# EAGLE design USB_MiniPower (EAGLE 7.7.0)
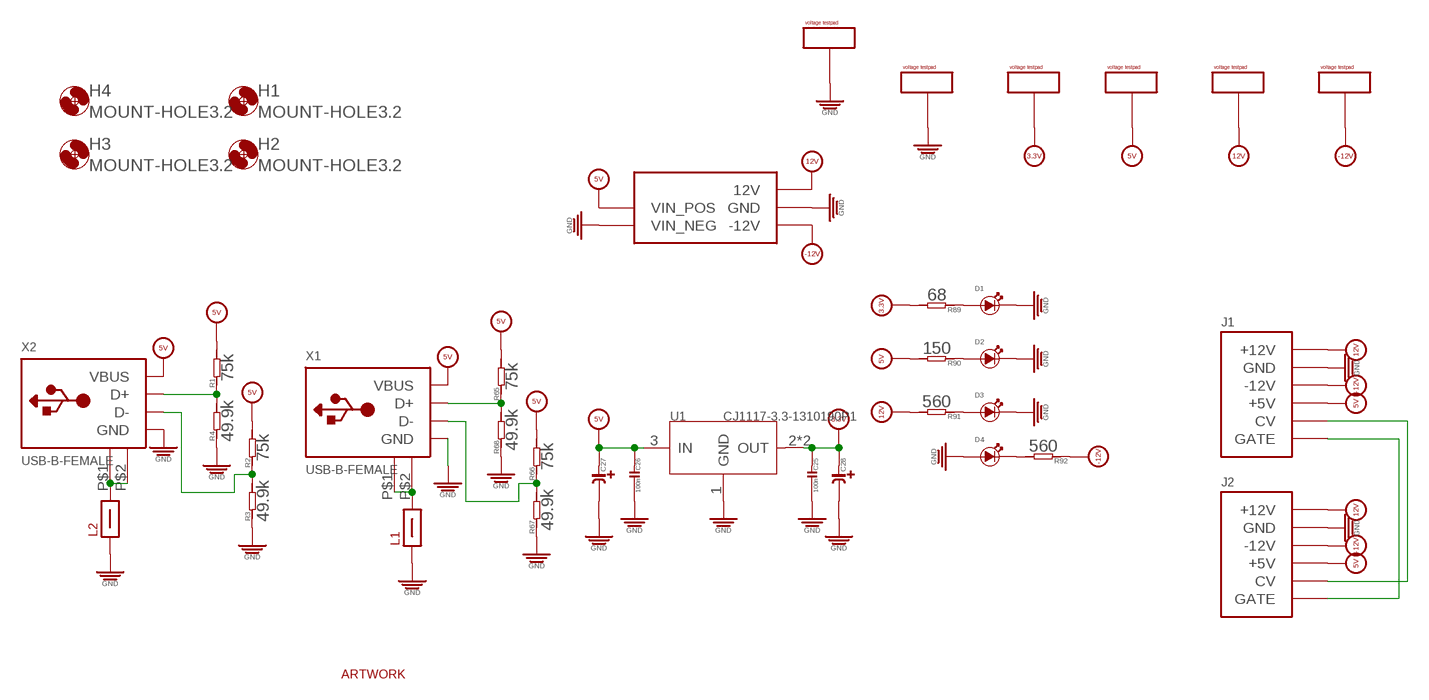
[diagram p0: schematic, sheet 1]

## Parts
C25  100n  C-0603  [C0603]
C26  100n  C-0603  [C0603]
C27  C-POLAR-A  [CASE-A_3216]
C28  C-POLAR-A  [CASE-A_3216]
D1  LED  [LED0603]
D2  LED  [LED0603]
D3  LED  [LED0603]
D4  LED  [LED0603]
H1  MOUNT-HOLE3.2  [3,2]
H2  MOUNT-HOLE3.2  [3,2]
H3  MOUNT-HOLE3.2  [3,2]
H4  MOUNT-HOLE3.2  [3,2]
J1  POWER_SHROUDED_NOTEXT  [POWER_16_SHROUDED_NOTEXT]
J2  POWERSHROUDED  [POWER_16_SHROUDED]
L1  FERRITE_1812  [FERRITE_1812]
L2  FERRITE_1812  [FERRITE_1812]
R1  75k  R-0603  [R0603]
R2  75k  R-0603  [R0603]
R3  49.9k  R-0603  [R0603]
R4  49.9k  R-0603  [R0603]
R65  75k  R-0603  [R0603]
R66  75k  R-0603  [R0603]
R67  49.9k  R-0603  [R0603]
R68  49.9k  R-0603  [R0603]
R89  68  R-0603  [R0603]
R90  150  R-0603  [R0603]
R91  560  R-0603  [R0603]
R92  560  R-0603  [R0603]
U1  CJ1117-3.3-1310190P1  [SOT223]
U$7  VOLTAGETESTPAD_BIG  [POWERTESTPAD_BIG]
U$8  VOLTAGETESTPAD_BIG  [POWERTESTPAD_BIG]
U$9  VOLTAGETESTPAD_BIG  [POWERTESTPAD_BIG]
U$10  VOLTAGETESTPAD_BIG  [POWERTESTPAD_BIG]
U$11  VOLTAGETESTPAD_BIG  [POWERTESTPAD_BIG]
U$16  VOLTAGETESTPAD_BIG  [POWERTESTPAD_BIG]
U$17  TINRS_ARTWORKTINYDATE  [JUSTATINYROCKET_DATECODE]
U$42  CINCONBRICK_12V  [CINCONBRICK]
X1  USB-B-FEMALE  [FCI61729]
X2  USB-B-FEMALE  [FCI61729]

## Nets
3.3V [5v]: C25.1 C28.+ R89.2 U1.2(OUT) U1.TER(OUT) U$7.P$1(VOLTAGE) U$7.P$2(VOLTAGE) U$7.P$3(VOLTAGE)
5V [5v]: C26.1 C27.+ J1.11(+5V) J1.12(+5V) J2.11(+5V) J2.12(+5V) R1.2 R2.2 R65.2 R66.2 R90.2 U1.3(IN) U$8.P$1(VOLTAGE) U$8.P$2(VOLTAGE) U$8.P$3(VOLTAGE) U$42.1(VIN_POS) U$42.24(VIN_POS) X1.1(VBUS) X2.1(VBUS)
12V [5v]: J1.9(+12V) J1.10(+12V) J2.9(+12V) J2.10(+12V) R91.2 U$9.P$1(VOLTAGE) U$9.P$2(VOLTAGE) U$9.P$3(VOLTAGE) U$42.11(12V) U$42.14(12V)
-12V [5v]: J1.1(-12V) J1.2(-12V) J2.1(-12V) J2.2(-12V) R92.1 U$10.P$1(VOLTAGE) U$10.P$2(VOLTAGE) U$10.P$3(VOLTAGE) U$42.2(-12V) U$42.23(-12V)
GND: C25.2 C26.2 C27.- C28.- D1.- D2.- D3.- D4.+ J1.3(GND) J1.4(GND) J1.5(GND) J1.6(GND) J1.7(GND) J1.8(GND) J2.3(GND) J2.4(GND) J2.5(GND) J2.6(GND) J2.7(GND) J2.8(GND) L1.P$1 L2.P$1 R3.1 R4.1 R67.1 R68.1 U1.1(GND) U$11.P$1(VOLTAGE) U$11.P$2(VOLTAGE) U$11.P$3(VOLTAGE) U$16.P$1(VOLTAGE) U$16.P$2(VOLTAGE) U$16.P$3(VOLTAGE) U$42.3(GND) U$42.10(GND) U$42.12(VIN_NEG) U$42.13(VIN_NEG) U$42.15(GND) U$42.22(GND) X1.4(GND) X2.4(GND)
N$1: J1.13(CV) J1.14(CV) J2.13(CV) J2.14(CV)
N$2: J1.15(GATE) J1.16(GATE) J2.15(GATE) J2.16(GATE)
N$3: L2.P$2 X2.P$1(GND1) X2.P$2(GND2)
N$4: L1.P$2 X1.P$1(GND1) X1.P$2(GND2)
N$5: R66.1 R67.2 X1.2(D-)
N$6: R65.1 R68.2 X1.3(D+)
N$7: R2.1 R3.2 X2.2(D-)
N$8: R1.1 R4.2 X2.3(D+)
N$11: D1.+ R89.1
N$12: D2.+ R90.1
N$13: D3.+ R91.1
N$19: D4.- R92.2

## Library data of the parts
C25 C26 = OPL:C*
C27 C28 = EurorackModularParts:C-POLAR*
D1-D4 = EurorackModularParts:LED*: LED
H1-H4 = holes:MOUNT-HOLE: MOUNTING HOLE with drill center marker
J1 J2 = EurorackModularParts:POWER
L1 L2 = EurorackModularParts:FERRITE
R1-R4 R65-R68 R89-R92 = OPL:R*
U1 = OPL:CJ1117-3.3: 1A Low Dropout Linear Regulator
U$7 = FenixBase:VOLTAGETESTPAD; DESC: 3.3V
U$8 = FenixBase:VOLTAGETESTPAD; DESC: 5V
U$9 = FenixBase:VOLTAGETESTPAD; DESC: 12V
U$10 = FenixBase:VOLTAGETESTPAD; DESC: -12V
U$11 U$16 = FenixBase:VOLTAGETESTPAD; DESC: GND
U$17 = EurorackModularParts:TINRS_ARTWORK
U$42 = FenixBase:CINCONBRICK_12V
X1 X2 = ld-components:USB-B-FEMALE: USB type B receptacle FCI 61729-59796

## Net classes
0 default: width 0.254 mm
1 5v: width 1 mm

## Board
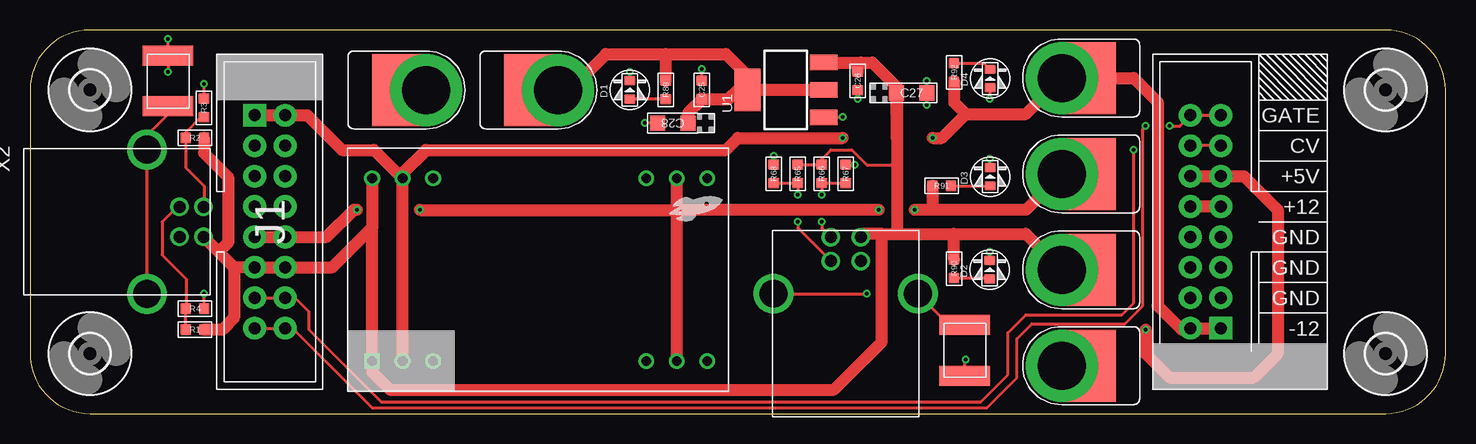
[diagram p1: board, top side]
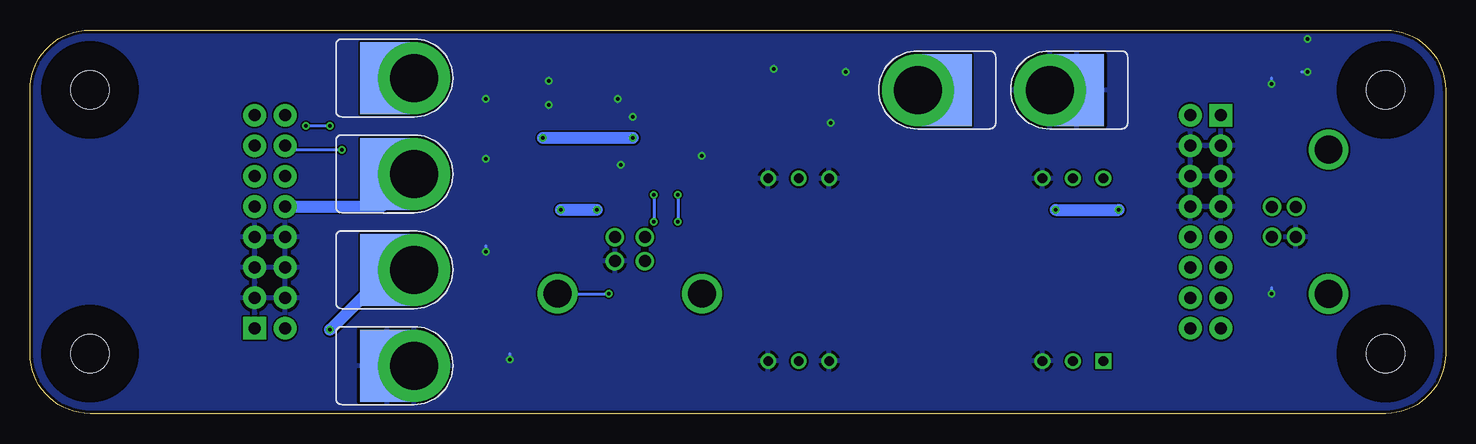
[diagram p2: board, bottom side, seen from below]

Size 118 x 32 mm. Coordinates in mm from the lower left corner, seen from the top.
Outline: 0,27 0,5 arc90 5,0 113,0 arc90 118,5 118,27 arc90 113,32 5,32 arc90 0,27
Copper layers (1*16): Top 0.035mm / dielectric 1.5mm / Bottom 0.035mm
Design rules "dirt_cheap_dirty_boards.v1.1": minimum track width 6mil, minimum drill 12mil, track to track 6mil, track to pad 6mil, pad to pad 6mil, via to via 6mil, smd to smd 0mil, copper to edge 10mil, drill to drill 10mil, minimum pad ring 10mil, minimum via ring 6mil, stop-mask expansion 2mil, vias tented up to drill 25mil, thermal gap 10mil

### Footprints (pad centres in the part's own frame; a part is rotated, then mirrored left to right if it is on the bottom)
C0603 = smd 0.889 x 0.889: 1 -0.762,0; 2 0.762,0
CASE-A_3216 = smd 1.27 x 1.27: + -1.27,0; - 1.27,0
LED0603 = smd 0.762 x 0.889: + -0.762,0; - 0.762,0
3,2 = hole 3.2: 0,0
POWER_16_SHROUDED_NOTEXT = drill 1.016 pad 1.88 square: 1 -8.89,-1.27 | drill 1.016 pad 1.88: 2 -8.89,1.27; 3 -6.35,-1.27; 4 -6.35,1.27; 5 -3.81,-1.27; 6 -3.81,1.27; 7 -1.27,-1.27; 8 -1.27,1.27; 9 1.27,-1.27; 10 1.27,1.27; 11 3.81,-1.27; 12 3.81,1.27; 13 6.35,-1.27; 14 6.35,1.27; 15 8.89,-1.27; 16 8.89,1.27
POWER_16_SHROUDED = drill 1.016 pad 1.88 square: 1 -8.89,-1.27 | drill 1.016 pad 1.88: 2 -8.89,1.27; 3 -6.35,-1.27; 4 -6.35,1.27; 5 -3.81,-1.27; 6 -3.81,1.27; 7 -1.27,-1.27; 8 -1.27,1.27; 9 1.27,-1.27; 10 1.27,1.27; 11 3.81,-1.27; 12 3.81,1.27; 13 6.35,-1.27; 14 6.35,1.27; 15 8.89,-1.27; 16 8.89,1.27
FERRITE_1812 = smd 1.665 x 4.22: P$1 -2.118,0; P$2 2.118,0
R0603 = smd 0.889 x 0.889: 1 -0.762,0; 2 0.762,0
SOT223 = smd 1.27 x 2.286: 1 -2.286,-3.175; 2 0,-3.175; 3 2.286,-3.175 | smd 3.556 x 2.159: TER 0,3.175
POWERTESTPAD_BIG = drill 4 pad 6: P$1 0,0 | smd 6 x 4.5: P$2 0,-2.25 | smd 6 x 4.5 bottom: P$3 0,-2.25
CINCONBRICK = drill 0.8 square: 1 -7.62,14.478 | drill 0.8: 2 -7.62,11.938; 3 -7.62,9.398; 10 -7.62,-8.382; 11 -7.62,-10.922; 12 -7.62,-13.462; 13 7.62,-13.462; 14 7.62,-10.922; 15 7.62,-8.382; 22 7.62,9.398; 23 7.62,11.938; 24 7.62,14.478
FCI61729 = drill 1: 1 1.25,4.71; 2 -1.25,4.71; 3 -1.25,2.71; 4 1.25,2.71 | drill 2.3: P$1 -6.02,0; P$2 6.02,0

### Placement (x,y rotation side)
C25  56,27 90 top
C26  69,27.75 270 top
C27  73.5,26.75 0 top
C28  53.59,24.23 180 top
D1  50,27 90 top
D2  80,12 90 top
D3  80.04,19.76 90 top
D4  80.04,27.95 90 top
H1  5,5 0 top
H2  5,27 0 top
H3  113,5 0 top
H4  113,27 0 top
J1  20,16 270 top
J2  98,16 90 top
L1  77.93,5.28 90 top
L2  11.5,27.75 270 top
R1  13.75,7 0 top
R2  13.75,23 0 top
R3  14.5,25.5 270 top
R4  13.75,8.75 180 top
R65  64,20 90 top
R66  66,20 90 top
R67  68,20 270 top
R68  62,20 270 top
R89  53,27 90 top
R90  77.04,12.09 90 top
R91  76,19 180 top
R92  77.04,28.47 90 top
U1  63,27 90 top
U$7  44,27 270 top
U$8  86,12 90 top
U$9  86,20 90 top
U$10  86,28 90 top
U$11  86,4 90 top
U$16  33,27 270 top
U$17  55.5,17.25 285 top
U$42  43,12 90 top
X1  68,10 0 top
X2  9.75,16 270 top

### Tracks (layer width: path | path; a pad name or v marks a point on that pad's centre or on a via)
3.3V
  Top 1: U1.TER 59,27 58.24,26.24 C25.1 54.86,25.1 C28.+ | U$7.P$1 45,27 48,30 53,30 | 53,30 58,30 60,28 60,27.18 U1.TER | R89.2 53,30 | U1.2 U1.TER
5V  (via drill 0.3)
  Top 0.25: R66.2 R65.2 65.76,20.76 66,21 66,21.25 66.75,22 68.5,22 69.75,20.75 72.25,20.75
  Top 1: 71,15 72,15 | 72,15 77,15 | 77,15 83,15 U$8.P$1 | 71,15 69.54,15 X1.1 | R90.2 77.04,14.96 77,15 | 28.52,15.52 25.19,12.19 J1.12 J1.11 17.02,12.19 | U$42.24 28.52,15.52 | J2.12 J2.11 101.19,19.81 104,17 104,5 102,3 95,3 93,5 v93,7 | U$8.P$3 88.25,11.75 | 28.52,15.52 U$42.1 28.52,3.48 30,2 67,2 71,6 71,15 | U1.3 69.25,29.29 | 69.25,29.29 70.21,29.29 72.25,27.25 72.25,23.02 | 72.25,23.02 C27.+ | 72.25,23.02 72.25,20.75 72.25,15.25 72,15 | C26.1 69,29.04 69.25,29.29 | 17.02,12.19 15.73,13.48 | 15.73,13.48 X2.1 | 17.02,12.19 17.02,8.02 16,7 R1.2 | R2.2 14.51,21.74 16.5,19.75 16.5,14.25 15.73,13.48
  Bottom 1: v93,7 88.75,11.25 88.75,11.5 U$8.P$3
12V  (via drill 0.3)
  Top 1: U$42.11 53.92,17 | 53.92,17 U$42.14 | U$9.P$1 83,17 75,17 | 75,17 v73.75,17 | v70.75,17 53.92,17 | J1.9 J1.10 24.73,14.73 27,17 v27.25,17 | v32.5,17 53.92,17 | R91.2 75.24,17.24 75,17 | J2.9 J2.10
  Bottom 1: J2.10 88.73,17.27 U$9.P$1 | v70.75,17 v73.75,17 | v32.5,17 v27.25,17
-12V  (via drill 0.3)
  Top 1: U$10.P$3 92,28 94,26 94,9 96,7 96.62,7 J2.2 J2.1 | J1.1 J1.2 23.11,24.89 26,22 28.68,22 U$42.23 | U$42.2 U$42.23 | U$42.23 31.06,20.06 33,22 58,22 59,23 v67.75,23 | 78,25 76,23 v75.25,23 | 78,25 83,25 U$10.P$1 | R92.1 77.04,25.96 78,25
  Bottom 1: v67.75,23 v75.25,23
GND  (via drill 0.3)
  Top 0.254: R67.1 68.74,20.76 v68.75,20.75 | U1.1 67.71,24.71 v67.75,24.75 | R68.1 v62,21.5 | C26.2 v69,26.25 | C28.- 51.27,24.23 v51.25,24.25 | D1.- v50,28.5 | C25.2 v56,28.75 | L1.P$1 77.93,4.43 v78,4.5 | D2.- v80,13.5 | D3.- 80.04,21.21 v80,21.25 | D4.+ 80.04,26.29 v80,26.25 | v74.75,25.75 74.77,25.77 C27.- 74.77,27.73 v74.75,27.75 | v11.5,28.5 L2.P$1 v11.5,31.25 | R4.1 14.51,9.99 v14.5,10 | R3.1 v14.5,27.5
  Bottom 0.254: v68.75,20.75 69,20.75 | v67.75,24.75 68,24.75 | v62,21.5 62,21.75 | v69,26.25 69,26 | v51.25,24.25 51,24.25 | v50,28.5 50,28.75 | v56,28.75 56,29 | v78,4.5 78,5 | v80,13.5 80,14 | v80,21.25 80,21.5 | v80,26.25 80.25,26.25 | v74.75,25.75 74.75,25.5 | v74.75,27.75 74.75,28 | v11.5,28.5 12,28.5 | v14.5,10 14.5,10.5 | v14.5,27.5 14.5,28
  pour Bottom: -3,35 116,35 arc-90 121,30 121,-7 2,-7 arc-90 -3,-2
N$1  (via drill 0.3)
  Top 0.254: J1.13 J1.14 22.1,9.65 23.25,8.5 23.25,7 29.25,1 79.25,1 81.5,3.25 81.5,6.75 83,8.25 91,8.25 92,9.25 v92,22 | J2.13 J2.14
  Bottom 0.254: v92,22 96.38,22 J2.14
N$2  (via drill 0.3)
  Top 0.254: J1.15 J1.16 21.89,7.11 28.5,0.5 79.75,0.5 82.25,3 82.25,6.25 83.5,7.5 91.25,7.5 92.75,9 92.75,23.75 v93,24 | J2.15 J2.16 95.84,24 v95,24
  Bottom 0.254: v93,24 v95,24
N$3
  Top 0.254: X2.P$2 X2.P$1 9.75,23.25 11.88,25.38 | 11.88,25.38 12.25,25.75 | L2.P$2 11.75,25.5 11.88,25.38
N$4  (via drill 0.3)
  Top 0.254: X1.P$1 v69.75,10 | L1.P$2 76.62,7.4 X1.P$2
  Bottom 0.254: X1.P$2 v69.75,10
N$5  (via drill 0.3)
  Top 0.254: X1.2 66,15.46 v66,16 | R67.2 R66.1 v66,18.25
  Bottom 0.254: v66,18.25 v66,16
N$6  (via drill 0.3)
  Top 0.254: R68.2 R65.1 v64,18.25 | X1.3 64,15.46 v64,16
  Bottom 0.254: v64,18.25 v64,16
N$7
  Top 0.254: R3.2 14.24,24.74 13,23.5 13,23.01 R2.1 12.99,20.51 14.5,19 14.5,17.29 X2.2
N$8
  Top 0.254: X2.3 12.25,17.25 11,16 11,13.25 13,11.25 13,8.76 R4.2 R1.1
N$11
  Top 0.254: R89.1 D1.+
N$12
  Top 0.254: R90.1 79.91,11.33 D2.+
N$13
  Top 0.254: R91.1 D3.+
N$19
  Top 0.254: R92.2 79.52,29.23 D4.-